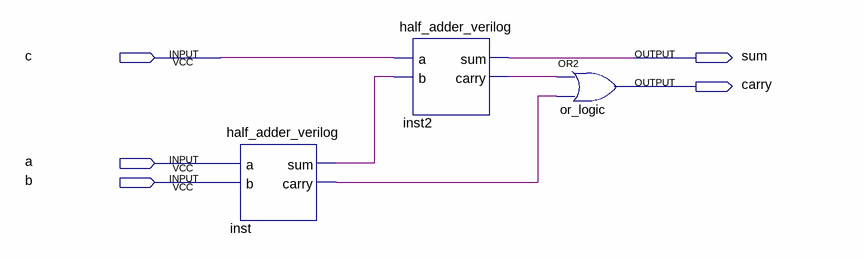
[diagram p0: schematic sheet]
// Quartus schematic full_adder_sch.bdf as structural Verilog: 3 symbols, 5 pins
module full_adder_sch (
  input  c,
  input  a,
  input  b,
  output sum,
  output carry
);

  wire inst2_carry, inst_carry, inst_sum;

  half_adder_verilog inst (.a(a), .b(b), .sum(inst_sum), .carry(inst_carry));
  half_adder_verilog inst2 (.a(c), .b(inst_sum), .sum(sum), .carry(inst2_carry));
  or or_logic (carry, inst2_carry, inst_carry);
endmodule
